# Altium schematic sheet station 2020.SchDoc
size A
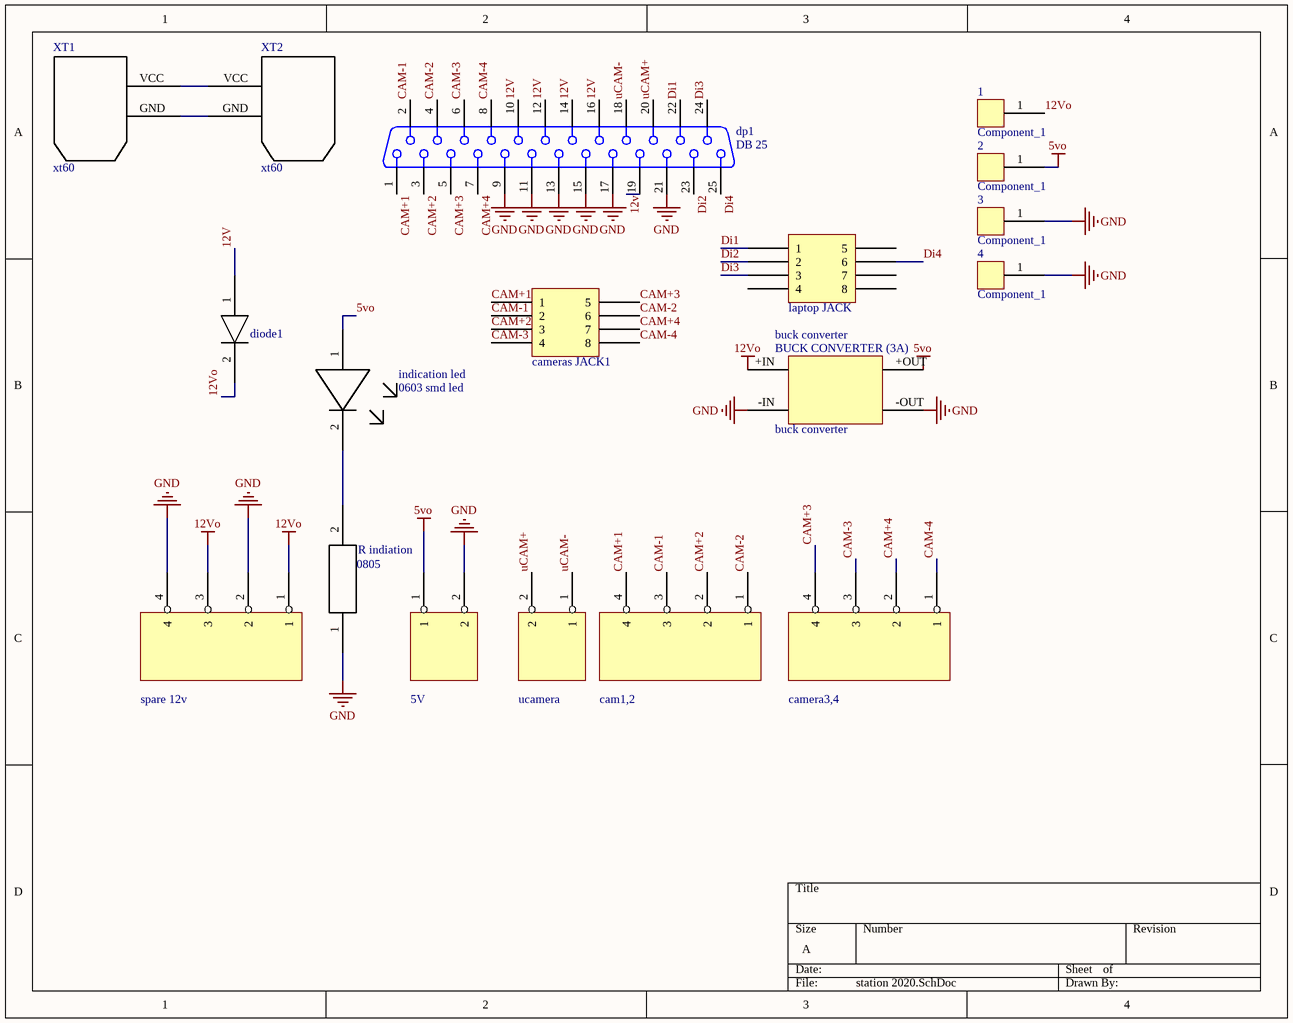
[diagram p0: station 2020.SchDoc]

## Parts
1  Component_1  [PCBComponent_1]
2  Component_1  [PCBComponent_1]
3  Component_1  [PCBComponent_1]
4  Component_1  [PCBComponent_1]
5V  Rossetta  [Rossetta 2-pin]  (value not drawn)
buck_converter  buck converter  [PCBComponent_1]
cam1,2  Rossetta 4-pin  [Rossetta 4-pin plugable]  (value not drawn)
camera3,4  Rossetta 4-pin  [Rossetta 4-pin plugable]  (value not drawn)
cameras_JACK1  ethernet jack  [Ethernet Jack With lED]  (value not drawn)
diode1  Diode  [Diode High Current]  (value not drawn)
dp1  DB 25  [DB25]
indication_led  0603 smd led  [0603  led]
laptop_JACK  ethernet jack  [Ethernet Jack With lED]  (value not drawn)
R_indiation  0805  [0805]
spare_12v  Rossetta 4-pin  [Rossetta 4-pin plugable]  (value not drawn)
ucamera  cam5  [Rossetta 2-pin Pugable]  (value not drawn)
XT1  xt60  [xt60]
XT2  xt60  [xt60]

## Nets
5vo: 2.1 5V.1 buck_converter.+OUT indication_led.1
12Vo: 1.1 buck_converter.+IN diode1.2 spare_12v.1 spare_12v.3
GND: 3.1 4.1 5V.2 buck_converter.-IN buck_converter.-OUT dp1.9 dp1.11 dp1.13 dp1.15 dp1.17 dp1.21 R_indiation.1 spare_12v.2 spare_12v.4
12v: diode1.1 dp1.10 dp1.12 dp1.14 dp1.16 dp1.19
CAM+1: cam1,2.4 cameras_JACK1.1 dp1.1
CAM+2: cam1,2.2 cameras_JACK1.3 dp1.3
CAM+3: camera3,4.4 cameras_JACK1.5 dp1.5
CAM+4: camera3,4.2 cameras_JACK1.7 dp1.7
CAM-1: cam1,2.3 cameras_JACK1.2 dp1.2
CAM-2: cam1,2.1 cameras_JACK1.6 dp1.4
CAM-3: camera3,4.3 cameras_JACK1.4 dp1.6
CAM-4: camera3,4.1 cameras_JACK1.8 dp1.8
Di1: dp1.22 laptop_JACK.1
Di2: dp1.23 laptop_JACK.2
Di3: dp1.24 laptop_JACK.3
Di4: dp1.25 laptop_JACK.6
uCAM+: dp1.20 ucamera.2
uCAM-: dp1.18 ucamera.1
Netindication_led_2: indication_led.2 R_indiation.2
NetXT1_GND: XT1.GND XT2.GND
NetXT1_VCC: XT1.VCC XT2.VCC

Not connected (* = marked no-connect by the designer): laptop_JACK 4 5 7 8

## Notes on the sheet
- (in symbol buck converter) BUCK CONVERTER (3A)

## Library data of the parts
cameras_JACK1 = ethernet jack: ethernet jack to 4ch balun (male HUB BNC Female terminal); Nour: Aldin
laptop_JACK = ethernet jack: Nour: Aldin
R_indiation = 0805 IMP resistor: supply chain link: https://lcsc.com/products/Chip-Resistor-Surface-Mount_439.html; data sheet link: https://datasheet.lcsc.com/szlcsc/YAGEO-RC0805JR-0747ML_C137426.pdf; created by: shahenda dora
ucamera = Rossetta
XT1 XT2 = xt60: Lithium-Ion Model Connectors XT60-M Rohs; created by: Hadeer Abouzeid; Data: 21/10/2019; datasheet: https://datasheet.lcsc.com/szlcsc/1810251322_Changzhou-Amass-Elec-XT60_C98733.pdf; Supply Chain LCSC: https://lcsc.com/product-detail/Connectors_Changzhou-Amass-Elec-XT60Male-head_C98733.html
cam1,2 camera3,4 spare_12v = Rossetta 4-pin: Created By: NourAldin
diode1 = Diode: Created By: Nour Aldin
indication_led = 0603 smd led: supply chain: https://lcsc.com/search?q=0603%20led; data sheet link: https://datasheet.lcsc.com/szlcsc/Orient-ORH-B36G_C193191.pdf; created by: shahenda dora